# Altium schematic sheet Power.SchDoc: Power Management Sheet (part 2 of 2)
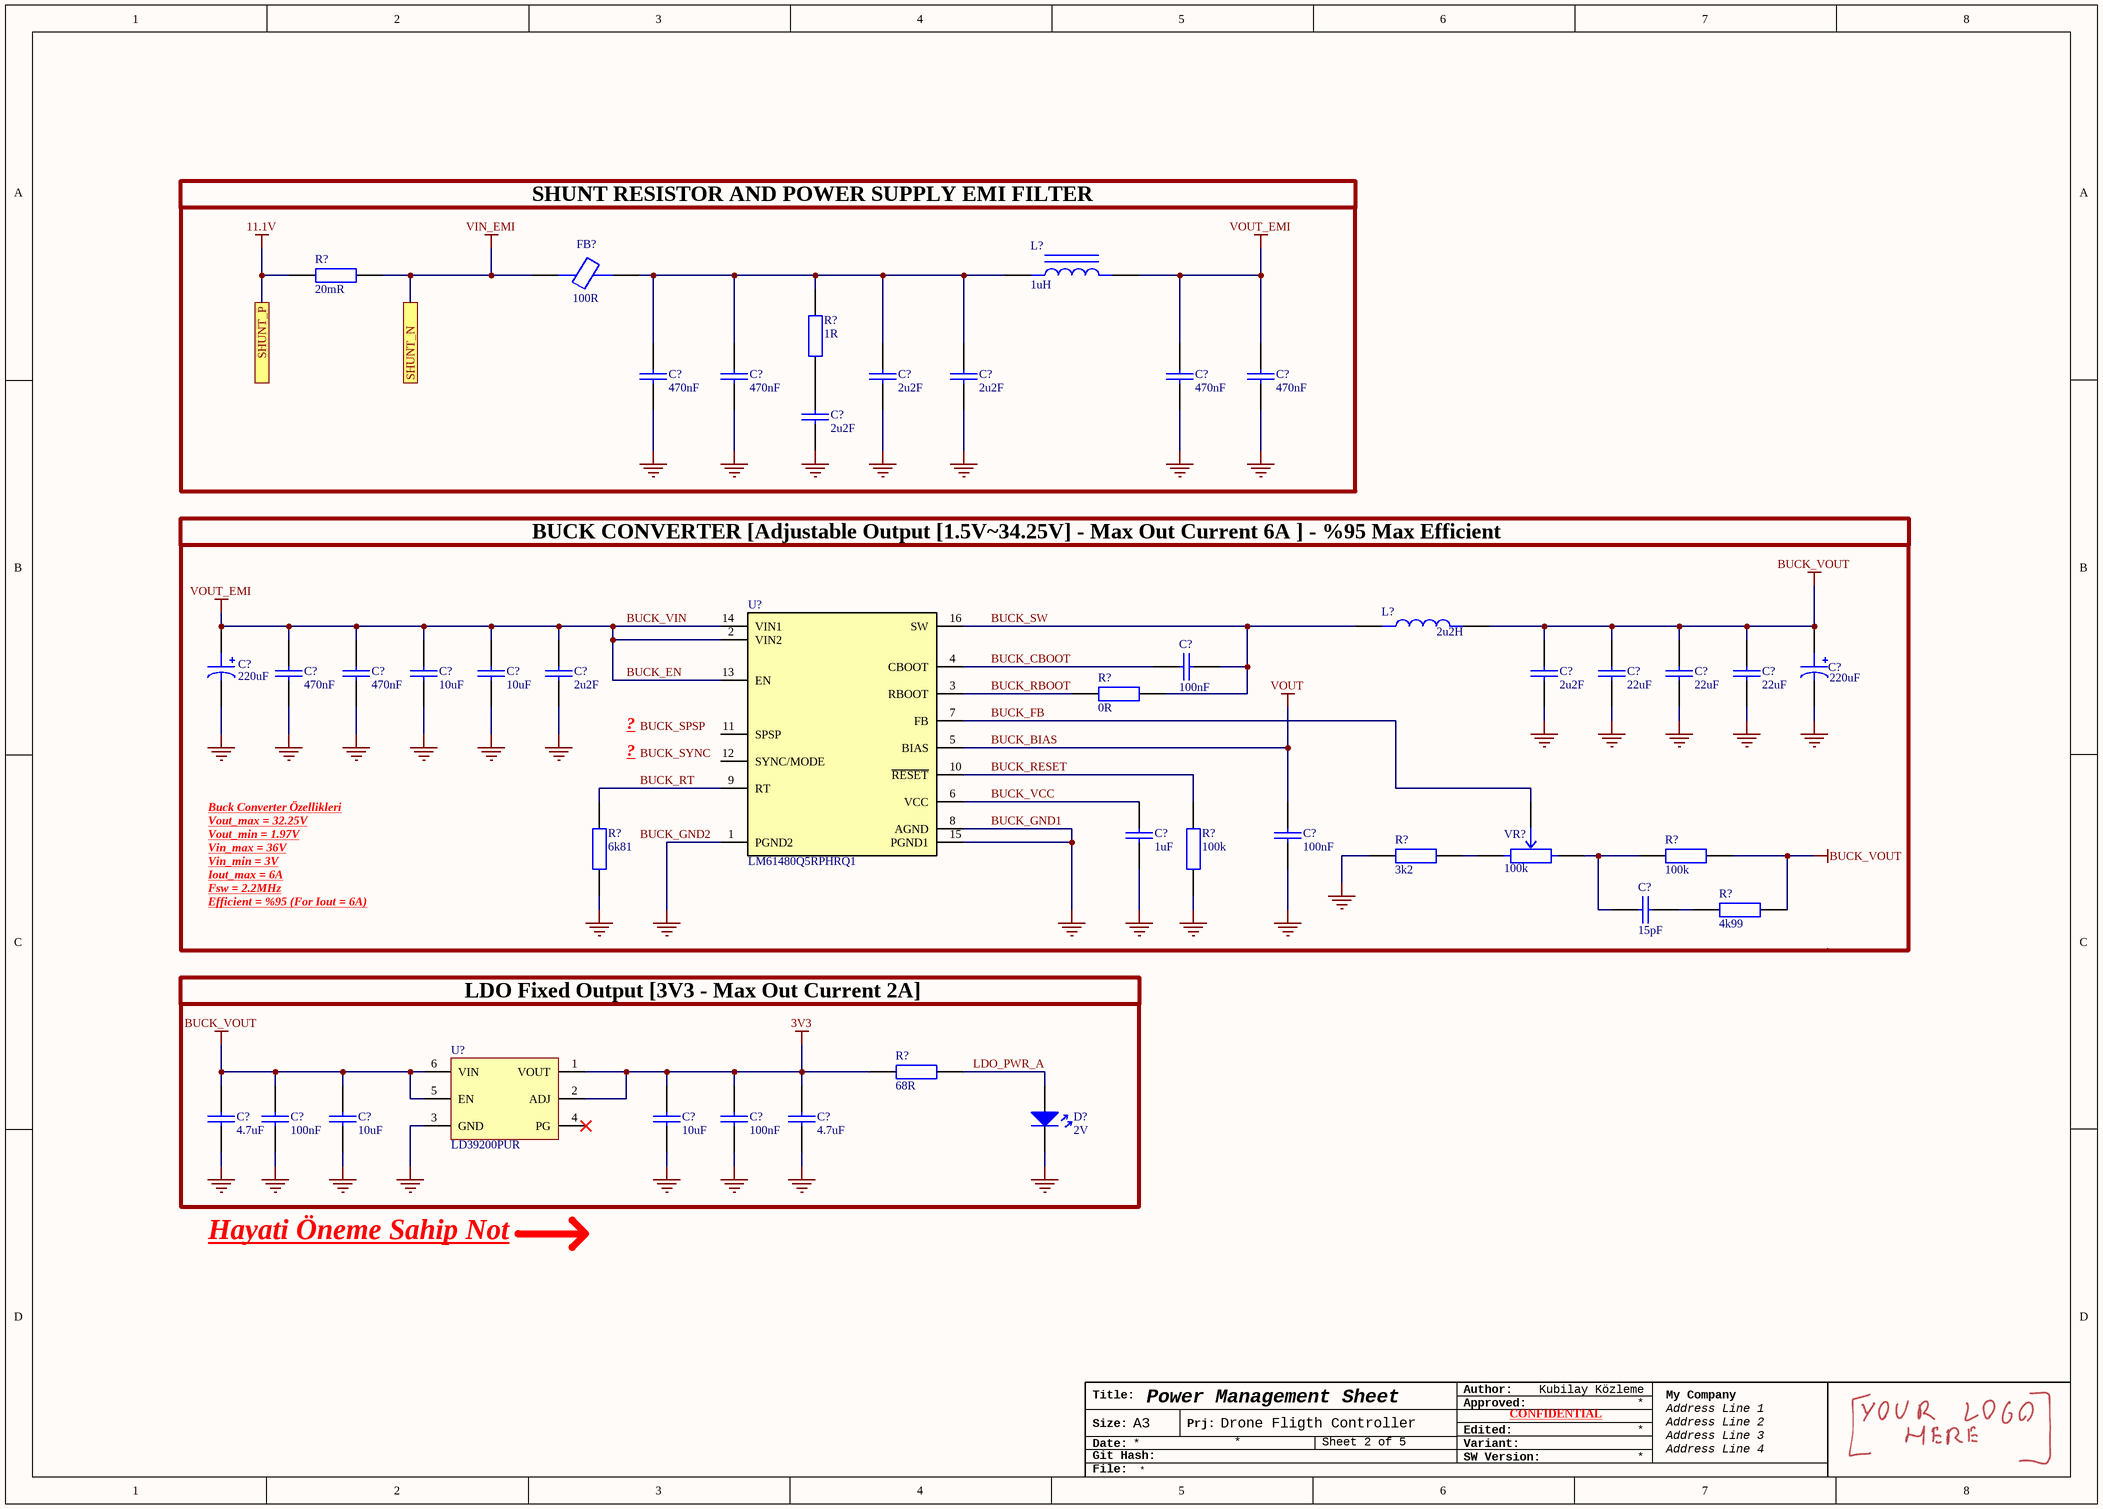
[diagram p1: Power.SchDoc]

## Library data of the parts
C?#1 C?#2 C?#5 C?#6 C?#11 C?#12 = CAP CER 470nF 0603: Ceramic Capacitor, Multilayer, Ceramic, 50V, 10% +Tol, 10% -Tol, X7R, 15% TC, 0.47uF, Surface Mount, 0603; Manufacturer: TDK; Designed By: Kubilay Közleme; Multilayer: Yes; Reference Standard: AEC-Q200; Supplier 1: Digikey; Manufacturer Part Number: CGA3E3X7R1H474K080AB; RoHS: Yes; Category: Ceramic Capacitors; Stock 1: 1178582; Pricing 1: 1=0.26, 10=0.15, 50=0.1066, 100=0.0932, 500=0.0704, 1000=0.0633 (USD); Mount: Surface Mount; Number of Pins: 2; Dielectric Material: Ceramic; Package Shape: Rectangular; Size Code: 0603; Terminal Finish: Nickel; Min Operating Temperature: -55°C; Max Operating Temperature: 125°C; JESD-609 Code: e3; Capacitor Type: Ceramic; Negative Tolerance: 10%; Package Style: SMTMeter; Packaging: Tape and Reel; Positive Tolerance: 10%; Rated DC Voltage (URdc): 50V; Temperature Characteristics Code: X7R; Termination: Wraparound; Length: 1.6mm; Width: 0.8mm; Height: 0.8mm; Reach SVHC Compliant: Yes; RoHS Compliant: Yes; ComponentLink1URL: https://datasheet.ciiva.com:443/pdfs/VipMasterIC/IC/TDKC/TDKC-S-A0008953915/TDKC-S-A0008953915-1.pdf?src-supplier=IHS+Markit; ComponentLink1Description: https://datasheet.ciiva.com:443/pdfs/VipMasterIC/IC/TDKC/TDKC-S-A0008953915/TDKC-S-A0008953915-1.pdf?src-supplier=IHS+Markit; ComponentLink2URL: http://www.mouser.com/ds/2/400/lcc_automotive_general_en-843974.pdf?src-supplier=Mouser; ComponentLink2Description: http://www.mouser.com/ds/2/400/lcc_automotive_general_en-843974.pdf?src-supplier=Mouser; ComponentLink3URL: https://4donline.ihs.com/images/VipMasterIC/IC/TDKC/TDKC-S-A0003616427/TDKC-S-A0003616427-1.pdf?hkey=52A5661711E402568146F3353EA87419&src-supplier=Farnell; ComponentLink3Description: https://4donline.ihs.com/images/VipMasterIC/IC/TDKC/TDKC-S-A0003616427/TDKC-S-A0003616427-1.pdf?hkey=52A5661711E402568146F3353EA87419&src-supplier=Farnell; ComponentLink4URL: https://product.tdk.com/info/en/documents/chara_sheet/CGA3E3X7R1H474K080AB.pdf?src-supplier=Digikey; ComponentLink4Description: https://product.tdk.com/info/en/documents/chara_sheet/CGA3E3X7R1H474K080AB.pdf?src-supplier=Digikey; ComponentLink5URL: https://datasheet.octopart.com/CGA3E3X7R1H474K080AB-TDK-datasheet-136412745.pdf?src-supplier=Newark; ComponentLink5Description: https://datasheet.octopart.com/CGA3E3X7R1H474K080AB-TDK-datasheet-136412745.pdf?src-supplier=Newark; ComponentLink6URL: https://4donline.ihs.com/images/VipMasterIC/IC/TDKC/TDKC-S-A0003616427/TDKC-S-A0003616427-1.pdf?hkey=52A5661711E402568146F3353EA87419&src-supplier=Newark; ComponentLink6Description: https://4donline.ihs.com/images/VipMasterIC/IC/TDKC/TDKC-S-A0003616427/TDKC-S-A0003616427-1.pdf?hkey=52A5661711E402568146F3353EA87419&src-supplier=Newark; ComponentLink7URL: https://datasheet.octopart.com/CGA3E3X7R1H474K080AB-TDK-datasheet-151546526.pdf?src-supplier=Future+Electronics; ComponentLink7Description: https://datasheet.octopart.com/CGA3E3X7R1H474K080AB-TDK-datasheet-151546526.pdf?src-supplier=Future+Electronics; ComponentLink8URL: https://product.tdk.com/info/en/catalog/datasheets/mlcc_automotive_general_en.pdf?ref_disty=digikey&src-supplier=Digikey; ComponentLink8Description: https://product.tdk.com/info/en/catalog/datasheets/mlcc_automotive_general_en.pdf?ref_disty=digikey&src-supplier=Digikey; ComponentLink9URL: http://product.tdk.com/capacitor/mlcc/class/print_detail_pdf.php?lang=en&part_no=CGA3E3X7R1H474K080AB&src-supplier=Avnet; ComponentLink9Description: http://product.tdk.com/capacitor/mlcc/class/print_detail_pdf.php?lang=en&part_no=CGA3E3X7R1H474K080AB&src-supplier=Avnet; ComponentLink10URL: https://product.tdk.com/info/en/catalog/datasheets/mlcc_automotive_general_en.pdf?src-supplier=Digikey; ComponentLink10Description: https://product.tdk.com/info/en/catalog/datasheets/mlcc_automotive_general_en.pdf?src-supplier=Digikey; ComponentLink11URL: https://datasheet.octopart.com/CGA3E3X7R1H474K080AB-TDK-datasheet-140571036.pdf?src-supplier=Arrow.cn; ComponentLink11Description: https://datasheet.octopart.com/CGA3E3X7R1H474K080AB-TDK-datasheet-140571036.pdf?src-supplier=Arrow.cn; ComponentLink12URL: https://datasheet.octopart.com/CGA3E3X7R1H474K080AB-TDK-datasheet-165583812.pdf?src-supplier=TME; ComponentLink12Description: https://datasheet.octopart.com/CGA3E3X7R1H474K080AB-TDK-datasheet-165583812.pdf?src-supplier=TME; Supplier Part Number 1: 445-175200-1-ND
C?#3 C?#4 C?#7 C?#15 C?#16 = CAP CER 2u2F 0805: Ceramic Capacitor, Multilayer, Ceramic, 50V, 10% +Tol, 10% -Tol, X7R, 15% TC, 2.2uF, Surface Mount, 0805; Manufacturer: KEMET; Designed By: Kubilay Közleme; Supplier 1: Digikey; Manufacturer Part Number: C0805C225K5RACAUTO; RoHS: No; Category: Ceramic Capacitors; Stock 1: 2500; Pricing 1: 2500=0.20006, 5000=0.18756, 12500=0.17193, 25000=0.1688 (USD); Supplier Part Number 1: 399-C0805C225K5RACAUTOTR-ND
C?#8 C?#9 = CAP ALU 220uF 50V: Cap Aluminum Lytic 220uF 50V 20% (8 X 10.2mm) SMD 0.18 Ohm 670mA 2000h 105C Automotive T/R; Manufacturer: Panasonic; Designed By: Kubilay Közleme; Supplier 1: Digikey; Manufacturer Part Number: EEE-FT1H221AL; RoHS: No; Category: Capacitors; Stock 1: 468; Pricing 1: 1=1.24, 10=0.773, 50=0.5852, 100=0.5266 (USD); ComponentLink1URL: https://datasheet.octopart.com/EEEFT1H221AL-Panasonic-datasheet-166314008.pdf?src-supplier=Farnell; ComponentLink1Description: https://datasheet.octopart.com/EEEFT1H221AL-Panasonic-datasheet-166314008.pdf?src-supplier=Farnell; Supplier Part Number 1: 10-EEE-FT1H221ALDKR-ND
C?#10 C?#21 = CAP CER 100nF 0805: Multilayer Ceramic Capacitor, 0.1 uF, 50 V, ï¿½ 10%, X7R, 0805 [2012 Metric]; Manufacturer: Samsung; Voltage Rating: 50V; Designed By: Kubilay Közleme; Supplier 1: Digikey; Manufacturer Part Number: CL21B104KBCNNNC; RoHS: Yes; Category: Ceramic Capacitors; Stock 1: 1683568; Pricing 1: 1=0.1, 10=0.042, 50=0.024, 100=0.0186, 500=0.01404, 1000=0.01103 (USD); Mount: Surface Mount; Case/Package: 0805; Case Code (Metric): 2012; Case Code (Imperial): 0805; Material: Ceramic; Min Operating Temperature: -55°C; Max Operating Temperature: 125°C; Tolerance: 10%; Dielectric: X7R; Packaging: Tape and Reel; Voltage: 50V; Series: CL; Construction: Flat; Voltage Rating (DC): 50V; Length: 2mm; Width: 0.049inch; Height: 0.85mm; Depth: 1.25mm; Thickness: 0.037inch; Radiation Hardening: No; RoHS Compliant: Yes; Lead Free: 5697LeadFree; ComponentLink1URL: https://datasheet.ciiva.com/25710/cl21b104kbcnnnc-25710182.pdf?src-supplier=Digikey; ComponentLink1Description: https://datasheet.ciiva.com/25710/cl21b104kbcnnnc-25710182.pdf?src-supplier=Digikey; ComponentLink2URL: https://datasheet.ciiva.com/29199/454152-da-01-en-vs-kondensator-0805-29199814.pdf?src-supplier=Conrad; ComponentLink2Description: https://datasheet.ciiva.com/29199/454152-da-01-en-vs-kondensator-0805-29199814.pdf?src-supplier=Conrad; Supplier Part Number 1: 1276-1003-6-ND
C?#13 C?#14 = CAP CER 10uF 50V 1206: Ceramic Capacitor, Multilayer, Ceramic, 50V, 10% +Tol, 10% -Tol, X7R, 15% TC, 10uF, Surface Mount, 1206; Manufacturer: Samsung; Multilayer: Yes; Designed By: Kubilay Közleme; Supplier 1: Digikey; Manufacturer Part Number: CL31B106KBHNNNE; RoHS: Yes; Category: Ceramic Capacitors; Stock 1: 930560; Pricing 1: 1=0.36, 10=0.21, 50=0.1516, 100=0.1333, 500=0.10224, 1000=0.09256 (USD); Mount: Surface Mount; Number of Pins: 2; Dielectric Material: Ceramic; Package Shape: Rectangular; Size Code: 1206; Terminal Finish: Nickel; Min Operating Temperature: -55°C; Max Operating Temperature: 125°C; JESD-609 Code: e3; Capacitor Type: Ceramic; Negative Tolerance: 10%; Package Style: SMTMeter; Packaging: Tape and Reel; Positive Tolerance: 10%; Rated DC Voltage (URdc): 50V; Temperature Characteristics Code: X7R; Termination: Wraparound; Length: 3.2mm; Width: 1.6mm; Height: 1.8mm; Reach SVHC Compliant: Yes; RoHS Compliant: Yes; ComponentLink1URL: https://datasheet.ciiva.com:443/pdfs/VipMasterIC/IC/SEMS/SEMS-S-A0008524842/SEMS-S-A0008524770-1.pdf?src-supplier=IHS+Markit; ComponentLink1Description: https://datasheet.ciiva.com:443/pdfs/VipMasterIC/IC/SEMS/SEMS-S-A0008524842/SEMS-S-A0008524770-1.pdf?src-supplier=IHS+Markit; ComponentLink2URL: https://datasheet.octopart.com/CL31B106KBHNNNE-Samsung-Electro-Mechanics-datasheet-149066874.pdf?src-supplier=Future+Electronics; ComponentLink2Description: https://datasheet.octopart.com/CL31B106KBHNNNE-Samsung-Electro-Mechanics-datasheet-149066874.pdf?src-supplier=Future+Electronics; ComponentLink3URL: http://www.samsungsem.com/kr/support/product-search/mlcc/CL31B106KBHNNNE.jsp?src-supplier=Digikey; ComponentLink3Description: http://www.samsungsem.com/kr/support/product-search/mlcc/CL31B106KBHNNNE.jsp?src-supplier=Digikey; ComponentLink4URL: https://datasheet.octopart.com/CL31B106KBHNNNE-Samsung-Electro-Mechanics-datasheet-110617700.pdf?src-supplier=LCSC; ComponentLink4Description: https://datasheet.octopart.com/CL31B106KBHNNNE-Samsung-Electro-Mechanics-datasheet-110617700.pdf?src-supplier=LCSC; Supplier Part Number 1: 1276-6767-6-ND
C?#17-C?#19 = CAP CER 22uF 0805: Commercial Grade, 0805, X5R, 35V, 22; Manufacturer: TDK; Designed By: Kubilay Közleme; Supplier 1: Digikey; Manufacturer Part Number: C2012X5R1V226M125DC; RoHS: No; Category: Ceramic Capacitors; Stock 1: 18749; Pricing 1: 1=0.96, 10=0.592, 50=0.4438, 100=0.3974, 500=0.31846, 1000=0.2938, 2500=0.26759, 5000=0.25169 (USD); Supplier Part Number 1: 445-C2012X5R1V226M125DCCT-ND
C?#20 = CAP CER 1uF 0805: Multilayer Ceramic Capacitor, 1 uF, 50 V, ï¿½ 10%, X7R, 0805 [2012 Metric]; Manufacturer: Samsung; Voltage Rating (DC): 50V; Designed By: Kubilay Közleme; Supplier 1: Digikey; Manufacturer Part Number: CL21B105KBFNNNE; RoHS: Yes; Category: Ceramic Capacitors; Stock 1: 1081238; Pricing 1: 1=0.11, 10=0.075, 50=0.045, 100=0.0354, 500=0.02616, 1000=0.02165 (USD); Mount: Surface Mount; Case/Package: 0805; Material: Ceramic; Case Code (Metric): 2012; Case Code (Imperial): 0805; Min Operating Temperature: -55°C; Max Operating Temperature: 125°C; Tolerance: 10%; Packaging: Tape and Reel; Package Quantity: 1; Voltage Rating: 50V; Dielectric: X7R; Voltage: 50V; Series: CL; Construction: Flat; Length: 2mm; Width: 0.049inch; Height: 1.25mm; Thickness: 0.053inch; Depth: 1.25mm; Radiation Hardening: No; RoHS Compliant: Yes; ComponentLink1URL: https://datasheet.ciiva.com/25800/cl21b105kbfnnne-25800291.pdf?src-supplier=Digikey; ComponentLink1Description: https://datasheet.ciiva.com/25800/cl21b105kbfnnne-25800291.pdf?src-supplier=Digikey; Supplier Part Number 1: 1276-1029-1-ND
C?#22 = CAP CER 15pF 0603: Ceramic Capacitor, Multilayer, Ceramic, 50V, 1% +Tol, 1% -Tol, C0G, 30ppm/Cel TC, 0.000015uF, Surface Mount, 0603; Manufacturer: Yageo; Multilayer: Yes; Designed By: Kubilay Közleme; Supplier 1: Digikey; Manufacturer Part Number: CC0603FRNPO9BN150; RoHS: Yes; Category: Ceramic Capacitors; Stock 1: 12018; Pricing 1: 1=0.17, 10=0.113, 50=0.0676, 100=0.0531, 500=0.03922, 1000=0.03246 (USD); Mount: Surface Mount; Number of Pins: 2; Dielectric Material: Ceramic; Package Shape: Rectangular; Size Code: 0603; Terminal Finish: Nickel; Min Operating Temperature: -55°C; Max Operating Temperature: 125°C; JESD-609 Code: e3; Capacitor Type: Ceramic; Negative Tolerance: 1%; Package Style: SMTMeter; Packaging: Tape and Reel; Positive Tolerance: 1%; Rated DC Voltage (URdc): 50V; Temperature Characteristics Code: C0G; Termination: Wraparound; Length: 1.6mm; Width: 0.8mm; Height: 0.8mm; Reach SVHC Compliant: Yes; RoHS Compliant: Yes; ComponentLink1URL: https://datasheet.ciiva.com:443/pdfs/VipMasterIC/IC/YAGO/YAGO-S-A0009251638/YAGO-S-A0009251638-1.pdf?src-supplier=IHS+Markit; ComponentLink1Description: https://datasheet.ciiva.com:443/pdfs/VipMasterIC/IC/YAGO/YAGO-S-A0009251638/YAGO-S-A0009251638-1.pdf?src-supplier=IHS+Markit; ComponentLink2URL: https://datasheet.ciiva.com/11586/upy-gp-np0-16v-to-50v-8-11586461.pdf?src-supplier=Avnet; ComponentLink2Description: https://datasheet.ciiva.com/11586/upy-gp-np0-16v-to-50v-8-11586461.pdf?src-supplier=Avnet; Supplier Part Number 1: 311-3887-6-ND
C?#23 C?#28 = CAP CER 4.7uF 0805: Multilayer Ceramic Capacitor, 4.7 uF, 25 V, ± 10%, X5R, 0805 [2012 Metric]; Manufacturer: Samsung; Voltage Rating: 25V; Designed By: Kubilay Közleme; Supplier 1: Digikey; Manufacturer Part Number: CL21A475KAQNNNE; RoHS: Yes; Category: Ceramic Capacitors; Stock 1: 3035721; Pricing 1: 1=0.1, 10=0.069, 50=0.0414, 100=0.0326, 500=0.02408, 1000=0.01994 (USD); Mount: Surface Mount; Case/Package: 0805; Case Code (Metric): 2012; Case Code (Imperial): 0805; Material: Ceramic; Min Operating Temperature: -55°C; Max Operating Temperature: 85°C; Packaging: Tape and Reel; Tolerance: 10%; Dielectric: X5R; Voltage Rating (DC): 25V; Series: CL; Construction: Flat; Length: 2mm; Height: 1.25mm; Depth: 1.25mm; Radiation Hardening: No; Lead Free: Lead Free; RoHS Compliant: Yes; ComponentLink1URL: https://datasheet.ciiva.com/25798/cl21a475kaqnnne-25798882.pdf?src-supplier=Digikey; ComponentLink1Description: https://datasheet.ciiva.com/25798/cl21a475kaqnnne-25798882.pdf?src-supplier=Digikey; Supplier Part Number 1: 1276-1244-1-ND
C?#24 C?#27 = CAP CER 100nF 0603: Cap Cer 0603 0.1UF 100VDC X7R; Manufacturer: KEMET; Dielectric: 1511DielectricType; Voltage Rating (DC): 100V; Designed By: Kubilay Közleme; Supplier 1: Digikey; Manufacturer Part Number: C0603C104K1RACTU; RoHS: No; Category: Ceramic Capacitors; Stock 1: 10169; Pricing 1: 1=0.28, 10=0.185, 50=0.1296, 100=0.1047, 500=0.07782, 1000=0.06808 (USD); Case/Package: 345Case; Supplier Part Number 1: 399-C0603C104K1RACTUCT-ND
C?#25 C?#26 = CAP CER 10uF 0603: Ceramic Capacitor, Multilayer, Ceramic, 16V, 20% +Tol, 20% -Tol, X5R, 15% TC, 10uF, Surface Mount, 0603; Manufacturer: Murata; Designed By: Kubilay Közleme; Supplier 1: Digikey; RoHS: Yes; Category: Ceramic Capacitors; Stock 1: 123060; Pricing 1: 1=0.48, 10=0.284, 50=0.2068, 100=0.1828, 500=0.14188, 1000=0.1291 (USD); Number of Pins: 2; Dielectric Material: Ceramic; Capacitor Type: Ceramic; Reach SVHC Compliant: Yes; RoHS Compliant: Yes; ComponentLink1URL: https://datasheet.ciiva.com:443/pdfs/VipMasterIC/IC/MURE/MURE-S-A0004380799/MURE-S-A0004414209-1.pdf?src-supplier=IHS+Markit; ComponentLink1Description: https://datasheet.ciiva.com:443/pdfs/VipMasterIC/IC/MURE/MURE-S-A0004380799/MURE-S-A0004414209-1.pdf?src-supplier=IHS+Markit; ComponentLink2URL: http://www.farnell.com/datasheets/2163235.pdf?src-supplier=Farnell; ComponentLink2Description: http://www.farnell.com/datasheets/2163235.pdf?src-supplier=Farnell; ComponentLink3URL: http://search.murata.co.jp/Ceramy/image/img/A01X/G101/ENG/ZRB18AR61C106ME01-01.pdf?src-supplier=Digikey; ComponentLink3Description: http://search.murata.co.jp/Ceramy/image/img/A01X/G101/ENG/ZRB18AR61C106ME01-01.pdf?src-supplier=Digikey; ComponentLink4URL: http://www.farnell.com/datasheets/2163235.pdf?src-supplier=Newark; ComponentLink4Description: http://www.farnell.com/datasheets/2163235.pdf?src-supplier=Newark; ComponentLink5URL: http://www.farnell.com/datasheets/2163235.pdf?src-supplier=Element14; ComponentLink5Description: http://www.farnell.com/datasheets/2163235.pdf?src-supplier=Element14; ComponentLink6URL: https://datasheet.octopart.com/ZRB18AR61C106ME01L-Murata-datasheet-62317488.pdf?src-supplier=Element14; ComponentLink6Description: https://datasheet.octopart.com/ZRB18AR61C106ME01L-Murata-datasheet-62317488.pdf?src-supplier=Element14; ComponentLink7URL: https://datasheet.octopart.com/ZRB18AR61C106ME01L-Murata-datasheet-67356777.pdf?src-supplier=Newark; ComponentLink7Description: https://datasheet.octopart.com/ZRB18AR61C106ME01L-Murata-datasheet-67356777.pdf?src-supplier=Newark; ComponentLink8URL: https://datasheet.octopart.com/ZRB18AR61C106ME01L-Murata-datasheet-86813782.pdf?src-supplier=Future+Electronics; ComponentLink8Description: https://datasheet.octopart.com/ZRB18AR61C106ME01L-Murata-datasheet-86813782.pdf?src-supplier=Future+Electronics; ComponentLink9URL: https://datasheet.octopart.com/ZRB18AR61C106ME01L-Murata-datasheet-166166242.pdf?src-supplier=TME; ComponentLink9Description: https://datasheet.octopart.com/ZRB18AR61C106ME01L-Murata-datasheet-166166242.pdf?src-supplier=TME; Supplier Part Number 1: 490-10990-6-ND; Manufacturer Part Number: ZRB18AR61C106ME01L
D? = LED RED CLEAR 0603 SMD: Single Color LED, Red, Water Clear, 1.1mm; Manufacturer: Wurth Electronics; Shape: Rectangular; Forward Current-Max: 30mA; Luminous Intensity-Nom: 250mcd; Number of Functions: 1; Viewing Angle: 140°; Overall Height: 0.7mm; Designed By: Kubilay Közleme; Supplier 1: Digikey; Manufacturer Part Number: 150060RS75000; RoHS: Yes; Category: LEDs; Stock 1: 140000; Pricing 1: 4000=0.105 (USD); Mount: Surface Mount; Number of Pins: 2; Color: Red; Min Operating Temperature: -40°C; Max Operating Temperature: 85°C; Lens Style: WATER CLEAR; Optoelectronic Device Type: SINGLE COLOR LED; Packaging: Tape and Reel; Size: 1.1mm; Terminal Pitch: 1.6mm; Reach SVHC Compliant: Yes; RoHS Compliant: Yes; ComponentLink1URL: https://datasheet.ciiva.com:443/pdfs/VipMasterIC/IC/MIDC/MIDC-S-A0007768849/MIDC-S-A0007768849-1.pdf?src-supplier=IHS+Markit; ComponentLink1Description: https://datasheet.ciiva.com:443/pdfs/VipMasterIC/IC/MIDC/MIDC-S-A0007768849/MIDC-S-A0007768849-1.pdf?src-supplier=IHS+Markit; ComponentLink2URL: https://datasheet.ciiva.com/29563/150060rs75000-29563040.pdf?src-supplier=Digikey; ComponentLink2Description: https://datasheet.ciiva.com/29563/150060rs75000-29563040.pdf?src-supplier=Digikey; ComponentLink3URL: https://datasheet.ciiva.com/29279/759428-da-01-en-chipled-0603-w-kl-rot-150060rs75000-29279196.pdf?src-supplier=Conrad; ComponentLink3Description: https://datasheet.ciiva.com/29279/759428-da-01-en-chipled-0603-w-kl-rot-150060rs75000-29279196.pdf?src-supplier=Conrad; Supplier Part Number 1: 732-4978-2-ND
FB? = 74279226101: Ferrite Chip, 1 Function(s), 8A, 2 Pin(s); Manufacturer: Wurth Electronics; DC Resistance-Max: 6mR; Max Frequency: 1.1GHz; Min Frequency: 100MHz; Number of Functions: 1; Designed By: Kubilay Közleme; Supplier 1: Digikey; Manufacturer Part Number: 74279226101; RoHS: Yes; Category: Ferrite Beads and Chips; Stock 1: 41612; Pricing 1: 1=0.68, 10=0.668, 100=0.645, 500=0.62, 1000=0.597 (USD); Mount: Surface Mount; Material: Ferrite; Case Code: 1812; Min Operating Temperature: -55°C; Max Operating Temperature: 125°C; Construction: Chip Bead; Filter Type: FERRITE CHIP; Packaging: Tape and Reel; Current Rating: 8A; Length: 4.5mm; Width: 3.2mm; Height: 2.3mm; Reach SVHC Compliant: Yes; RoHS Compliant: Yes; ComponentLink1URL: https://datasheet.ciiva.com:443/pdfs/VipMasterIC/IC/MIDC/MIDC-S-A0008919821/MIDC-S-A0008919731-1.pdf?src-supplier=IHS+Markit; ComponentLink1Description: https://datasheet.ciiva.com:443/pdfs/VipMasterIC/IC/MIDC/MIDC-S-A0008919821/MIDC-S-A0008919731-1.pdf?src-supplier=IHS+Markit; ComponentLink2URL: https://datasheet.ciiva.com/11795/0900766b8103b532-11795775.pdf?src-supplier=Rs; ComponentLink2Description: https://datasheet.ciiva.com/11795/0900766b8103b532-11795775.pdf?src-supplier=Rs; ComponentLink3URL: https://datasheet.ciiva.com/1126/1696196-1126762.pdf?src-supplier=Element14; ComponentLink3Description: https://datasheet.ciiva.com/1126/1696196-1126762.pdf?src-supplier=Element14; ComponentLink4URL: https://datasheet.ciiva.com/6212/74279226101-6212616.pdf?src-supplier=Digikey; ComponentLink4Description: https://datasheet.ciiva.com/6212/74279226101-6212616.pdf?src-supplier=Digikey; ComponentLink5URL: https://datasheet.ciiva.com/4940/74279226101-72150-4940419.pdf?src-supplier=Mouser; ComponentLink5Description: https://datasheet.ciiva.com/4940/74279226101-72150-4940419.pdf?src-supplier=Mouser; ComponentLink6URL: https://datasheet.ciiva.com/23762/74279226101-23762966.pdf?src-supplier=Newark; ComponentLink6Description: https://datasheet.ciiva.com/23762/74279226101-23762966.pdf?src-supplier=Newark; ComponentLink7URL: https://datasheet.ciiva.com/6212/74279226101-6212619.pdf?src-supplier=Digikey; ComponentLink7Description: https://datasheet.ciiva.com/6212/74279226101-6212619.pdf?src-supplier=Digikey; ComponentLink8URL: https://datasheet.ciiva.com/1013/74279226101-1013739.pdf?src-supplier=Digikey; ComponentLink8Description: https://datasheet.ciiva.com/1013/74279226101-1013739.pdf?src-supplier=Digikey; ComponentLink9URL: https://datasheet.ciiva.com/48698/001087019-da-01-ml-we-mpsb-emi-mult-pow-sup-bead74279-de-en-48698459.pdf?src-supplier=Conrad; ComponentLink9Description: https://datasheet.ciiva.com/48698/001087019-da-01-ml-we-mpsb-emi-mult-pow-sup-bead74279-de-en-48698459.pdf?src-supplier=Conrad; Supplier Part Number 1: 732-3431-6-ND
L?#1 = 74437336010: General Purpose Inductor, 1uH, 20%, 1 Element, Powdered  Iron-Core, SMD, 2220; Manufacturer: Wurth Electronics; Designed By: Kubilay Közleme; Supplier 1: Digikey; Manufacturer Part Number: 74437336010; RoHS: Yes; Category: Fixed Inductors; Stock 1: 2161; Pricing 1: 1=2.71, 50=2.517, 100=2.289, 250=2.08, 500=1.891 (USD); Terminal Finish: Copper; JESD-609 Code: e2; Inductor Type: GENERAL PURPOSE INDUCTOR; Manufacturer Series: 74437336010; Reach SVHC Compliant: Yes; RoHS Compliant: Yes; ComponentLink1URL: https://datasheet.ciiva.com:443/pdfs/VipMasterIC/IC/MIDC/MIDC-S-A0001528209/MIDC-S-A0001528770-1.pdf?src-supplier=IHS+Markit; ComponentLink1Description: https://datasheet.ciiva.com:443/pdfs/VipMasterIC/IC/MIDC/MIDC-S-A0001528209/MIDC-S-A0001528770-1.pdf?src-supplier=IHS+Markit; ComponentLink2URL: http://www.farnell.com/datasheets/1880907.pdf?src-supplier=Farnell; ComponentLink2Description: http://www.farnell.com/datasheets/1880907.pdf?src-supplier=Farnell; ComponentLink3URL: https://katalog.we-online.de/pbs/datasheet/74437336010.pdf?src-supplier=Digikey; ComponentLink3Description: https://katalog.we-online.de/pbs/datasheet/74437336010.pdf?src-supplier=Digikey; ComponentLink4URL: http://www.farnell.com/datasheets/1880907.pdf?src-supplier=Element14; ComponentLink4Description: http://www.farnell.com/datasheets/1880907.pdf?src-supplier=Element14; Supplier Part Number 1: 732-6162-6-ND
L?#2 = ETQ-P4M2R2KVC: Power Choke Shielded Wirewound 2.2uH 20% 100KHz Metal 14.8A 0.00748Ohm DCR Automotive T/R; Manufacturer: Panasonic; Designed By: Kubilay Közleme; Supplier 1: Digikey; Manufacturer Part Number: ETQ-P4M2R2KVC; RoHS: Yes; Category: Fixed Inductors; Stock 1: 1000; Pricing 1: 1=1.01, 10=0.853, 25=0.7756, 50=0.729, 100=0.605, 250=0.55844 (USD); ComponentLink1URL: https://datasheet.ciiva.com:443/pdfs/VipMasterIC/IC/PANA/PANA-S-A0009325573/PANA-S-A0009325573-1.pdf?src-supplier=IHS+Markit; ComponentLink1Description: https://datasheet.ciiva.com:443/pdfs/VipMasterIC/IC/PANA/PANA-S-A0009325573/PANA-S-A0009325573-1.pdf?src-supplier=IHS+Markit; ComponentLink2URL: https://media.digikey.com/pdf/Data%20Sheets/Panasonic%20Inductors%20Coils%20Filters%20PDFs/ETQ-P_Series_NPI.pdf?src-supplier=Digikey; ComponentLink2Description: https://media.digikey.com/pdf/Data%20Sheets/Panasonic%20Inductors%20Coils%20Filters%20PDFs/ETQ-P_Series_NPI.pdf?src-supplier=Digikey; ComponentLink3URL: http://www.farnell.com/datasheets/2144948.pdf?src-supplier=Element14; ComponentLink3Description: http://www.farnell.com/datasheets/2144948.pdf?src-supplier=Element14; ComponentLink4URL: https://datasheet.octopart.com/ETQP4M2R2KVC-Panasonic-datasheet-137675050.pdf?src-supplier=TME; ComponentLink4Description: https://datasheet.octopart.com/ETQP4M2R2KVC-Panasonic-datasheet-137675050.pdf?src-supplier=TME; Supplier Part Number 1: PCD2462CT-ND
R?#1 = VMP-R020-1.0-U: 20 mOhms ±1% 3W Chip Resistor 2010 (5025 Metric) Automotive AEC-Q200, Current Sense, Moisture Resistant, Pulse Withstanding; Manufacturer: Isabellenhütte; Designed By: Kubilay Közleme; Supplier 1: Digikey; Manufacturer Part Number: VMP-R020-1.0-U; RoHS: No; Stock 1: 15796; Pricing 1: 1=2.72, 10=1.607, 25=1.3224, 50=1.148, 100=1.0025, 250=0.84608, 500=0.74984, 1000=0.675 (USD); Supplier Part Number 1: 4423-VMP-R020-1.0-UCT-ND
R?#2 = RES 1 OHM 0603: Fixed Resistor, Metal Glaze/thick Film, 0.1W, 1ohm, 75V, 1% +/-Tol, 200ppm/Cel, Surface Mount, 0603; Manufacturer: Vishay; Rated Power Dissipation (P): 100mW; Rated Temperature: 70°C; Temperature Coefficient: 200ppm/°C; Reference Standard: AEC-Q200; Designed By: Kubilay Közleme; Supplier 1: Digikey; Manufacturer Part Number: CRCW06031R00FNEA; RoHS: Yes; Category: Chip SMD Resistors; Stock 1: 25000; Pricing 1: 5000=0.0109, 10000=0.00971, 25000=0.00848, 35000=0.00829, 50000=0.00772, 125000=0.00711 (USD); Mount: Surface Mount; Number of Pins: 2; Package Shape: Rectangular; Size Code: 0603; Terminal Finish: Nickel; Min Operating Temperature: -55°C; Max Operating Temperature: 155°C; Tolerance: 1%; JESD-609 Code: e3; Resistor Type: FIXED RESISTOR; Packaging: Tape and Reel; Technology: METAL GLAZE/THICK FILM; Termination: Wraparound; Working Voltage: 75V; Reach SVHC Compliant: Yes; RoHS Compliant: Yes; ComponentLink1URL: https://datasheet.ciiva.com:443/pdfs/VipMasterIC/IC/VISH/VISH-S-A0001536853/VISH-S-A0001536853-1.pdf?src-supplier=IHS+Markit; ComponentLink1Description: https://datasheet.ciiva.com:443/pdfs/VipMasterIC/IC/VISH/VISH-S-A0001536853/VISH-S-A0001536853-1.pdf?src-supplier=IHS+Markit; ComponentLink2URL: https://datasheet.ciiva.com/22746/1697337-22746475.pdf?src-supplier=Element14; ComponentLink2Description: https://datasheet.ciiva.com/22746/1697337-22746475.pdf?src-supplier=Element14; ComponentLink3URL: https://datasheet.ciiva.com/26316/fld-crcw-e3-data-en-26316616.pdf?src-supplier=Distrelec; ComponentLink3Description: https://datasheet.ciiva.com/26316/fld-crcw-e3-data-en-26316616.pdf?src-supplier=Distrelec; ComponentLink4URL: https://datasheet.ciiva.com/2562/dcrcwe3-2562503.pdf?src-supplier=Digikey; ComponentLink4Description: https://datasheet.ciiva.com/2562/dcrcwe3-2562503.pdf?src-supplier=Digikey; ComponentLink5URL: https://datasheet.ciiva.com/2562/dcrcwe3-2562504.pdf?src-supplier=Digikey; ComponentLink5Description: https://datasheet.ciiva.com/2562/dcrcwe3-2562504.pdf?src-supplier=Digikey; ComponentLink6URL: https://datasheet.ciiva.com/2562/dcrcwe3-2562502.pdf?src-supplier=Digikey; ComponentLink6Description: https://datasheet.ciiva.com/2562/dcrcwe3-2562502.pdf?src-supplier=Digikey; ComponentLink7URL: https://datasheet.ciiva.com/16757/70201119-16757960.pdf?src-supplier=Allied+Electronics; ComponentLink7Description: https://datasheet.ciiva.com/16757/70201119-16757960.pdf?src-supplier=Allied+Electronics; ComponentLink8URL: https://datasheet.ciiva.com/5550/dcrcwe3-109170-5550824.pdf?src-supplier=Mouser; ComponentLink8Description: https://datasheet.ciiva.com/5550/dcrcwe3-109170-5550824.pdf?src-supplier=Mouser; ComponentLink9URL: https://datasheet.ciiva.com/3257/dcrcwe3-3257227.pdf?src-supplier=Avnet; ComponentLink9Description: https://datasheet.ciiva.com/3257/dcrcwe3-3257227.pdf?src-supplier=Avnet; ComponentLink10URL: https://datasheet.ciiva.com/16430/dcrcwe3-16430109.pdf?src-supplier=Future+Electronics; ComponentLink10Description: https://datasheet.ciiva.com/16430/dcrcwe3-16430109.pdf?src-supplier=Future+Electronics; Supplier Part Number 1: 541-1.00HTR-ND
R?#3 = RES 0 OHM 0603: GENERAL PURPOSE CHIP RESISTOR Metal Glaze/thick Film, 0.1W, 0ohm, Surface Mount, 0603; Manufacturer: Yageo; Tolerance: 1%; Power Rating: 100mW; Voltage Rating (DC): 50V; Temperature Coefficient: 200ppm/°C; Resistance Tolerance: 5%; Designed By: Kubilay Közleme; Supplier 1: Digikey; Manufacturer Part Number: RC0603JR-070RL; RoHS: Yes; Category: Chip SMD Resistors; Stock 1: 2772986; Pricing 1: 5000=0.00203, 10000=0.00177, 25000=0.00155, 50000=0.00142, 125000=0.00139 (USD); Case/Package: 0603; Number of Pins: 2; Contact Plating: Tin,Matte; Case Code (Imperial): 0603; Case Code (Metric): 1608; Size Code: 0603; Min Operating Temperature: -55°C; Max Operating Temperature: 155°C; Resistor Type: Thick Film; Packaging: Tape and Reel; Termination: SMD/SMT; Series: RC; Technology: THICK FILM; Package Quantity: 5000; Voltage Rating: 50V; Features: Moisture Resistant; Max Power Dissipation: 100mW; Number of Terminations: 2; Construction: Rectangular; Length: 1.6mm; Width: 0.8mm; Height: 0.45mm; Depth: 0.8mm; Reach SVHC Compliant: Unknown; Lead Free: 5697LeadFree; RoHS Compliant: Yes; Military Standard: Not; Supplier Part Number 1: 311-0.0GRTR-ND
R?#4 = RES 3K2 OHM 0603: Fixed Resistor, Thin Film, 0.1W, 3200ohm, 75V, 0.1% +/-Tol, 25ppm/Cel, Surface Mount, 0603; Manufacturer: Yageo; Manufacturer Series: RT; Rated Power Dissipation (P): 100mW; Rated Temperature: 70°C; Temperature Coefficient: 25ppm/°C; Package Height: 0.45mm; Package Length: 1.6mm; Package Width: 0.8mm; Designed By: Kubilay Közleme; Supplier 1: Digikey; Manufacturer Part Number: RT0603BRD073K2L; RoHS: Yes; Category: Chip SMD Resistors; Stock 1: 7725; Pricing 1: 1=0.15, 10=0.105, 50=0.0824, 100=0.0741, 500=0.05716, 1000=0.05084 (USD); Mount: Surface Mount; Number of Pins: 2; Package Shape: Rectangular; Size Code: 0603; Terminal Finish: Nickel; Min Operating Temperature: -55°C; Max Operating Temperature: 155°C; Tolerance: 0.1%; JESD-609 Code: e3; Resistor Type: FIXED RESISTOR; Construction: Chip; Package Style: SMTMeter; Packaging: Tape and Reel; Series: RT; Technology: THIN FILM; Termination: Wraparound; Working Voltage: 75V; Reach SVHC Compliant: Yes; RoHS Compliant: Yes; ComponentLink1URL: https://datasheet.ciiva.com:443/pdfs/VipMasterIC/IC/YAGO/YAGOS01974/YAGOS01974-1.pdf?src-supplier=IHS+Markit; ComponentLink1Description: https://datasheet.ciiva.com:443/pdfs/VipMasterIC/IC/YAGO/YAGOS01974/YAGOS01974-1.pdf?src-supplier=IHS+Markit; ComponentLink2URL: http://www.yageo.com/documents/recent/PYu-RT_1-to-0.01_RoHS_L_8.pdf?src-supplier=Digikey; ComponentLink2Description: http://www.yageo.com/documents/recent/PYu-RT_1-to-0.01_RoHS_L_8.pdf?src-supplier=Digikey; Supplier Part Number 1: 13-RT0603BRD073K2LCT-ND
R?#5 R?#7 = RES 100K OHM 0603: Fixed Resistor, Metal Glaze/thick Film, 0.1W, 100000ohm, 75V, 1% +/-Tol, 100ppm/Cel, Surface Mount, 0603; Manufacturer: Vishay; Designed By: Kubilay Közleme; Rated Power Dissipation (P): 100mW; Rated Temperature: 70°C; Temperature Coefficient: 100ppm/°C; Package Height: 0.45mm; Package Length: 1.55mm; Package Width: 0.85mm; Reference Standard: AEC-Q200; Supplier 1: Digikey; Manufacturer Part Number: CRCW0603100KFKEA; RoHS: Yes; Category: Chip SMD Resistors; Stock 1: 208155; Pricing 1: 1=0.1, 10=0.026, 50=0.0166, 100=0.014, 500=0.00954, 1000=0.00824 (USD); Mount: Surface Mount; Number of Pins: 2; Package Shape: Rectangular; Size Code: 0603; Terminal Finish: Nickel; Min Operating Temperature: -55°C; Max Operating Temperature: 155°C; Tolerance: 1%; JESD-609 Code: e3; Resistor Type: FIXED RESISTOR; Construction: Chip; Package Style: SMTMeter; Packaging: Tape and Reel; Technology: METAL GLAZE/THICK FILM; Termination: Wraparound; Working Voltage: 75V; Reach SVHC Compliant: Yes; RoHS Compliant: Yes; ComponentLink1URL: https://datasheet.ciiva.com:443/pdfs/VipMasterIC/IC/VISH/VISH-S-A0007266705/VISH-S-A0007266705-1.pdf?src-supplier=IHS+Markit; ComponentLink1Description: https://datasheet.ciiva.com:443/pdfs/VipMasterIC/IC/VISH/VISH-S-A0007266705/VISH-S-A0007266705-1.pdf?src-supplier=IHS+Markit; ComponentLink2URL: http://www.farnell.com/datasheets/2310790.pdf?src-supplier=Farnell; ComponentLink2Description: http://www.farnell.com/datasheets/2310790.pdf?src-supplier=Farnell; ComponentLink3URL: http://www.farnell.com/datasheets/2310790.pdf?src-supplier=Element14; ComponentLink3Description: http://www.farnell.com/datasheets/2310790.pdf?src-supplier=Element14; ComponentLink4URL: http://www.farnell.com/datasheets/2310790.pdf?src-supplier=Newark; ComponentLink4Description: http://www.farnell.com/datasheets/2310790.pdf?src-supplier=Newark; ComponentLink5URL: https://datasheet.octopart.com/CRCW0603100KFKEA-Vishay-datasheet-5300368.pdf?src-supplier=Future+Electronics; ComponentLink5Description: https://datasheet.octopart.com/CRCW0603100KFKEA-Vishay-datasheet-5300368.pdf?src-supplier=Future+Electronics; ComponentLink6URL: https://datasheet.octopart.com/CRCW0603100KFKEA-Vishay-datasheet-14722531.pdf?src-supplier=Newark; ComponentLink6Description: https://datasheet.octopart.com/CRCW0603100KFKEA-Vishay-datasheet-14722531.pdf?src-supplier=Newark; ComponentLink7URL: https://www.vishay.com/docs/20035/dcrcwe3.pdf?src-supplier=Digikey; ComponentLink7Description: https://www.vishay.com/docs/20035/dcrcwe3.pdf?src-supplier=Digikey; ComponentLink8URL: https://datasheet.octopart.com/CRCW0603100KFKEA-Vishay-datasheet-8363642.pdf?src-supplier=Verical; ComponentLink8Description: https://datasheet.octopart.com/CRCW0603100KFKEA-Vishay-datasheet-8363642.pdf?src-supplier=Verical; ComponentLink9URL: https://datasheet.octopart.com/CRCW0603100KFKEA-Vishay-datasheet-83961561.pdf?src-supplier=Element14; ComponentLink9Description: https://datasheet.octopart.com/CRCW0603100KFKEA-Vishay-datasheet-83961561.pdf?src-supplier=Element14; ComponentLink10URL: https://datasheet.octopart.com/CRCW0603100KFKEA-Vishay-datasheet-508714.pdf?src-supplier=Farnell; ComponentLink10Description: https://datasheet.octopart.com/CRCW0603100KFKEA-Vishay-datasheet-508714.pdf?src-supplier=Farnell; ComponentLink11URL: https://datasheet.octopart.com/CRCW0603100KFKEA-Vishay-datasheet-17834126.pdf?src-supplier=TME; ComponentLink11Description: https://datasheet.octopart.com/CRCW0603100KFKEA-Vishay-datasheet-17834126.pdf?src-supplier=TME; Supplier Part Number 1: 541-100KHCT-ND
R?#6 = RES 6K81 OHM 0603: Fixed Resistor, Thin Film, 0.1W, 6810ohm, 75V, 0.1% +/-Tol, 25ppm/Cel, Surface Mount, 0603; Manufacturer: Yageo; Rated Power Dissipation (P): 100mW; Rated Temperature: 70°C; Temperature Coefficient: 25ppm/°C; Package Height: 0.45mm; Package Length: 1.6mm; Package Width: 0.8mm; Designed By: Kubilay Közleme; Supplier 1: Digikey; Manufacturer Part Number: RT0603BRD076K81L; RoHS: Yes; Category: Chip SMD Resistors; Stock 1: 8441; Pricing 1: 1=0.14, 10=0.102, 50=0.0846, 100=0.0755, 500=0.05712, 1000=0.051 (USD); Mount: Surface Mount; Number of Pins: 2; Size Code: 0603; Min Operating Temperature: -55°C; Max Operating Temperature: 155°C; Tolerance: 0.1%; Resistor Type: FIXED RESISTOR; Construction: Chip; Package Style: SMTMeter; Packaging: Tape and Reel; Technology: THIN FILM; Termination: Wraparound; Working Voltage: 75V; Reach SVHC Compliant: Yes; RoHS Compliant: Yes; ComponentLink1URL: https://datasheet.ciiva.com:443/pdfs/VipMasterIC/IC/YAGO/YAGO-S-A0008510989/YAGO-S-A0008510989-1.pdf?src-supplier=IHS+Markit; ComponentLink1Description: https://datasheet.ciiva.com:443/pdfs/VipMasterIC/IC/YAGO/YAGO-S-A0008510989/YAGO-S-A0008510989-1.pdf?src-supplier=IHS+Markit; ComponentLink2URL: https://datasheet.ciiva.com/12809/pyu-rt-1-to-0-05-rohs-l-4-12809852.pdf?src-supplier=Mouser; ComponentLink2Description: https://datasheet.ciiva.com/12809/pyu-rt-1-to-0-05-rohs-l-4-12809852.pdf?src-supplier=Mouser; Supplier Part Number 1: YAG1723CT-ND
R?#8 = RES 4K99 OHM 0603: Fixed Resistor, Metal Glaze/thick Film, 0.1W, 4990ohm, 75V, 1% +/-Tol, 100ppm/Cel, Surface Mount, 0603; Manufacturer: Yageo; Designed By: Kubilay Közleme; Temperature Coefficient: 100ppm/°C; Additional Feature: LASER TRIMMABLE; Rated Power Dissipation (P): 100mW; Rated Temperature: 70°C; Package Height: 0.45mm; Package Length: 1.6mm; Package Width: 0.8mm; Supplier 1: Digikey; Manufacturer Part Number: RC0603FR-074K99L; RoHS: Yes; Category: Chip SMD Resistors; Stock 1: 1699601; Pricing 1: 1=0.1, 10=0.012, 50=0.0096, 100=0.0071, 500=0.00612, 1000=0.0051 (USD); Mount: Surface Mount; Number of Pins: 2; Package Shape: Rectangular; Size Code: 0603; Terminal Finish: Nickel; Min Operating Temperature: -55°C; Max Operating Temperature: 155°C; Tolerance: 1%; Packaging: Tape and Reel; JESD-609 Code: e3; Resistor Type: FIXED RESISTOR; Construction: Chip; Package Style: SMTMeter; Technology: METAL GLAZE/THICK FILM; Termination: Wraparound; Working Voltage: 75V; Reach SVHC Compliant: Yes; RoHS Compliant: Yes; ComponentLink1URL: https://datasheet.ciiva.com:443/pdfs/VipMasterIC/IC/YAGO/YAGO-S-A0008145938/YAGO-S-A0008145938-1.pdf?src-supplier=IHS+Markit; ComponentLink1Description: https://datasheet.ciiva.com:443/pdfs/VipMasterIC/IC/YAGO/YAGO-S-A0008145938/YAGO-S-A0008145938-1.pdf?src-supplier=IHS+Markit; Supplier Part Number 1: 311-4.99KHRDKR-ND
R?#9 = RES 68 OHM 0603: Fixed Resistor, Metal Glaze/thick Film, 0.1W, 68ohm, 75V, 1% +/-Tol, 100ppm/Cel, Surface Mount, 0603; Manufacturer: Yageo; Designed By: Kubilay Közleme; Additional Feature: LASER TRIMMABLE; Rated Power Dissipation (P): 100mW; Rated Temperature: 70°C; Temperature Coefficient: 100ppm/°C; Package Height: 0.45mm; Package Length: 1.6mm; Package Width: 0.8mm; Supplier 1: Digikey; Manufacturer Part Number: RC0603FR-0768RL; RoHS: Yes; Category: Chip SMD Resistors; Stock 1: 432379; Pricing 1: 1=0.1, 10=0.019, 50=0.0112, 100=0.0093, 500=0.00622, 1000=0.00532 (USD); Mount: Surface Mount; Number of Pins: 2; Package Shape: Rectangular; Size Code: 0603; Terminal Finish: Nickel; Min Operating Temperature: -55°C; Max Operating Temperature: 155°C; Tolerance: 1%; JESD-609 Code: e3; Resistor Type: FIXED RESISTOR; Construction: Chip; Package Style: SMTMeter; Packaging: Tape and Reel; Technology: METAL GLAZE/THICK FILM; Termination: Wraparound; Working Voltage: 75V; Reach SVHC Compliant: Yes; RoHS Compliant: Yes; ComponentLink1URL: https://datasheet.ciiva.com:443/pdfs/VipMasterIC/IC/YAGO/YAGO-S-A0008145938/YAGO-S-A0008145938-1.pdf?src-supplier=IHS+Markit; ComponentLink1Description: https://datasheet.ciiva.com:443/pdfs/VipMasterIC/IC/YAGO/YAGO-S-A0008145938/YAGO-S-A0008145938-1.pdf?src-supplier=IHS+Markit; ComponentLink2URL: https://datasheet.ciiva.com/11809/0900766b80f96399-11809282.pdf?src-supplier=Rs; ComponentLink2Description: https://datasheet.ciiva.com/11809/0900766b80f96399-11809282.pdf?src-supplier=Rs; ComponentLink3URL: https://datasheet.ciiva.com/2454/pyu-r-int-thick-7-2454067.pdf?src-supplier=Digikey; ComponentLink3Description: https://datasheet.ciiva.com/2454/pyu-r-int-thick-7-2454067.pdf?src-supplier=Digikey; ComponentLink4URL: https://datasheet.ciiva.com/2454/pyu-r-int-thick-7-2454068.pdf?src-supplier=Digikey; ComponentLink4Description: https://datasheet.ciiva.com/2454/pyu-r-int-thick-7-2454068.pdf?src-supplier=Digikey; ComponentLink5URL: https://datasheet.ciiva.com/2454/pyu-r-int-thick-7-2454066.pdf?src-supplier=Digikey; ComponentLink5Description: https://datasheet.ciiva.com/2454/pyu-r-int-thick-7-2454066.pdf?src-supplier=Digikey; ComponentLink6URL: https://datasheet.ciiva.com/7746/443971-7746393.pdf?src-supplier=Element14; ComponentLink6Description: https://datasheet.ciiva.com/7746/443971-7746393.pdf?src-supplier=Element14; ComponentLink7URL: https://datasheet.ciiva.com/7746/443971-7746392.pdf?src-supplier=Element14; ComponentLink7Description: https://datasheet.ciiva.com/7746/443971-7746392.pdf?src-supplier=Element14; ComponentLink8URL: https://datasheet.ciiva.com/15189/getdatasheetpartid-325369-15189803.pdf?src-supplier=Verical; ComponentLink8Description: https://datasheet.ciiva.com/15189/getdatasheetpartid-325369-15189803.pdf?src-supplier=Verical; Supplier Part Number 1: 311-68.0HRDKR-ND
U?#1 = LM61480Q5RPHRQ1: Switching Regulator, Current-mode, 8A, 2420kHz Switching Freq-Max, PQCC16; Manufacturer: Texas Instruments; Designed By: Kubilay Közleme; Supplier 1: Digikey; Manufacturer Part Number: LM61480Q5RPHRQ1; RoHS: No; Category: Voltage Regulators - Switching; Stock 1: 574; Pricing 1: 1=5.79, 10=4.278, 25=3.8988, 100=3.4823, 250=3.28356, 500=3.16372, 1000=3.06507 (USD); RoHS Compliant: Yes; Supplier Part Number 1: 296-LM61480Q5RPHRQ1DKR-ND
U?#2 = LD39200PUR: Adjustable Positive LDO Regulator, 0.5V Min, 5.75V Max, 0.25V Dropout; Manufacturer: STMicroelectronics; Regulator Type: ADJUSTABLE POSITIVE SINGLE OUTPUT LDO REGULATOR; Designed By: Kubilay Közleme; Supplier 1: Digikey; Manufacturer Part Number: LD39200PUR; RoHS: Yes; Category: Voltage Regulators - Linear; Stock 1: 34356; Pricing 1: 1=1.06, 10=0.951, 25=0.9028, 100=0.7417, 250=0.69336, 500=0.61274, 1000=0.48374 (USD); Reach SVHC Compliant: Yes; RoHS Compliant: Yes; ComponentLink1URL: https://datasheet.ciiva.com:443/pdfs/VipMasterIC/IC/SGST/SGST-S-A0006334684/SGST-S-A0006334684-1.pdf?src-supplier=IHS+Markit; ComponentLink1Description: https://datasheet.ciiva.com:443/pdfs/VipMasterIC/IC/SGST/SGST-S-A0006334684/SGST-S-A0006334684-1.pdf?src-supplier=IHS+Markit; ComponentLink2URL: http://www.farnell.com/datasheets/2815831.pdf?src-supplier=Farnell; ComponentLink2Description: http://www.farnell.com/datasheets/2815831.pdf?src-supplier=Farnell; ComponentLink3URL: http://www.farnell.com/datasheets/2815831.pdf?src-supplier=Newark; ComponentLink3Description: http://www.farnell.com/datasheets/2815831.pdf?src-supplier=Newark; ComponentLink4URL: http://www.farnell.com/datasheets/2815831.pdf?src-supplier=Element14; ComponentLink4Description: http://www.farnell.com/datasheets/2815831.pdf?src-supplier=Element14; ComponentLink5URL: https://datasheet.octopart.com/LD39200PUR-STMicroelectronics-datasheet-104525727.pdf?src-supplier=Future+Electronics; ComponentLink5Description: https://datasheet.octopart.com/LD39200PUR-STMicroelectronics-datasheet-104525727.pdf?src-supplier=Future+Electronics; ComponentLink6URL: http://www.st.com/content/ccc/resource/technical/document/datasheet/4b/e6/2e/a4/16/04/46/9d/DM00102135.pdf/files/DM00102135.pdf/jcr:content/translations/en.DM00102135.pdf?src-supplier=Digikey; ComponentLink6Description: http://www.st.com/content/ccc/resource/technical/document/datasheet/4b/e6/2e/a4/16/04/46/9d/DM00102135.pdf/files/DM00102135.pdf/jcr:content/translations/en.DM00102135.pdf?src-supplier=Digikey; ComponentLink7URL: https://datasheet.octopart.com/LD39200PUR-STMicroelectronics-datasheet-62333363.pdf?src-supplier=SHENGYU+ELECTRONICS; ComponentLink7Description: https://datasheet.octopart.com/LD39200PUR-STMicroelectronics-datasheet-62333363.pdf?src-supplier=SHENGYU+ELECTRONICS; Supplier Part Number 1: 497-17110-1-ND
VR? = 3313J-1-104E: Trimmer, Cermet, 0.125W, 100000ohm, 200V, 20% +/-Tol, 100ppm/Cel, 1 Turn(s), 1413; Manufacturer: Bourns; Manufacturer Series: 3313; Actuator Orientation: Vertical; Actuator Type: SCREW; Number of Turns: 1; Rated Power Dissipation (P): 125mW; Rated Temperature: 70°C; Resistance Law: Linear; Rotational Angle: 250°; Temperature Coefficient: -100100ppm/°C; Package Height: 2.2mm; Package Length: 3.2mm; Package Width: 3.5mm; Designed By: Kubilay Közleme; Supplier 1: Digikey; Manufacturer Part Number: 3313J-1-104E; RoHS: Yes; Category: Variable Resistors and Potentiometers; Stock 1: 40223; Pricing 1: 1=1.83, 10=1.611, 25=1.4444, 50=1.3888, 100=1.3332, 250=1.27764, 500=1.05544 (USD); Mount: Surface Mount; Number of Pins: 3; Package Shape: Rectangular; Size Code: 1214; Terminal Finish: Tin; Min Operating Temperature: -55°C; Max Operating Temperature: 125°C; Tolerance: 20%; JESD-609 Code: e3; Resistor Type: TRIMMER; Construction: Rectangular; Package Style: SMTMeter; Packaging: Tape and Reel; Series: 3313; Technology: CERMET; Termination: Wraparound; Reach SVHC Compliant: Yes; RoHS Compliant: Yes; ComponentLink1URL: https://datasheet.ciiva.com:443/pdfs/VipMasterIC/IC/BOUR/BOUR-S-A0002523373/BOUR-S-A0002523373-1.pdf?src-supplier=IHS+Markit; ComponentLink1Description: https://datasheet.ciiva.com:443/pdfs/VipMasterIC/IC/BOUR/BOUR-S-A0002523373/BOUR-S-A0002523373-1.pdf?src-supplier=IHS+Markit; ComponentLink2URL: https://datasheet.ciiva.com/6197/1695326-6197399.pdf?src-supplier=Farnell; ComponentLink2Description: https://datasheet.ciiva.com/6197/1695326-6197399.pdf?src-supplier=Farnell; ComponentLink3URL: https://datasheet.ciiva.com/7953/1864507-7953226.pdf?src-supplier=Element14; ComponentLink3Description: https://datasheet.ciiva.com/7953/1864507-7953226.pdf?src-supplier=Element14; ComponentLink4URL: https://datasheet.ciiva.com/3266/3313-3266620.pdf?src-supplier=Avnet; ComponentLink4Description: https://datasheet.ciiva.com/3266/3313-3266620.pdf?src-supplier=Avnet; ComponentLink5URL: https://datasheet.ciiva.com/15156/getdatasheetpartid-133405-15156637.pdf?src-supplier=Verical; ComponentLink5Description: https://datasheet.ciiva.com/15156/getdatasheetpartid-133405-15156637.pdf?src-supplier=Verical; Supplier Part Number 1: 3313J-104EDKR-ND